# Altium schematic sheet BQ76930.SchDoc
size A4; SheetNumber: 3; SheetTotal: 5
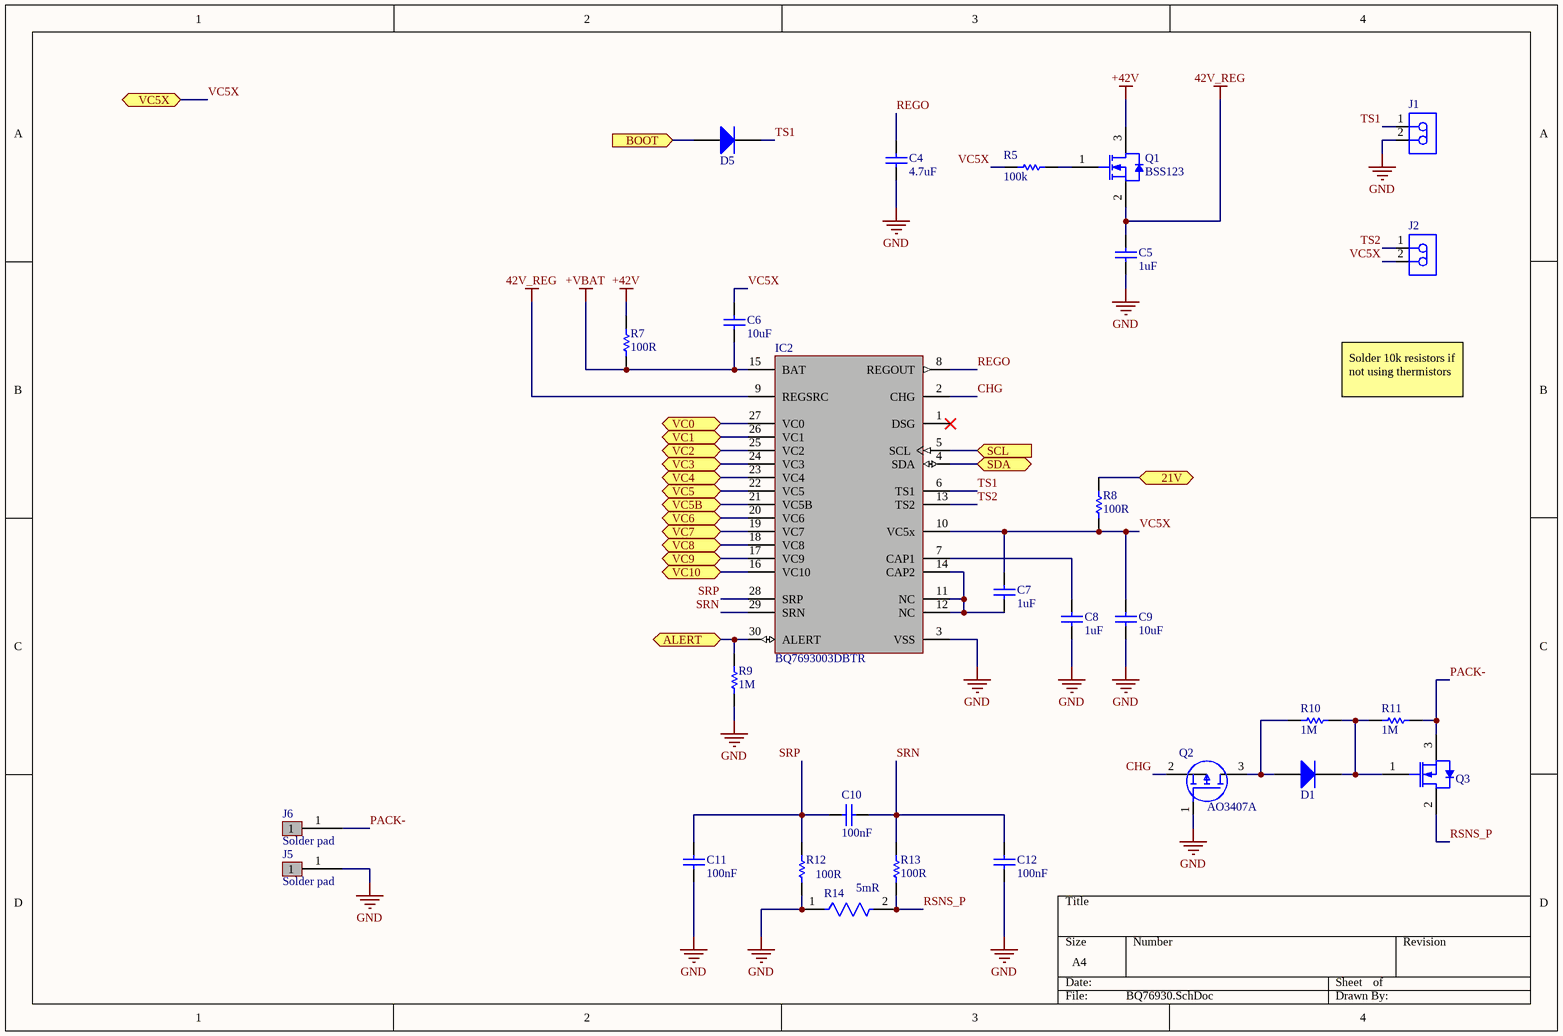
[diagram p0: BQ76930.SchDoc]

## Parts
C4  value 4.7uF  [Wurth 0603 capacitor]  (hidden comment: Generic Capacitor 4.7uF 0603)
C5  value 1uF  [Wurth 0603 capacitor]  (hidden comment: Generic Capacitor 1uF 0603)
C6  value 10uF  [Wurth 0603 capacitor]  (hidden comment: Generic Capacitor 10uF 0603)
C7  value 1uF  [Wurth 0603 capacitor]  (hidden comment: Generic Capacitor 1uF 0603)
C8  value 1uF  [Wurth 0603 capacitor]  (hidden comment: Generic Capacitor 1uF 0603)
C9  value 10uF  [Wurth 0603 capacitor]  (hidden comment: Generic Capacitor 10uF 0603)
C10  value 100nF  [Wurth 0603 capacitor]  (hidden comment: Generic Capacitor 100nF 0603)
C11  value 100nF  [Wurth 0603 capacitor]  (hidden comment: Generic Capacitor 100nF 0603)
C12  value 100nF  [Wurth 0603 capacitor]  (hidden comment: Generic Capacitor 100nF 0603)
D1  1N4148W-7-F  [DIOD-SOD123-2_V]  (value not drawn)
D5  1N4148W-7-F  [DIOD-SOD123-2_V]  (value not drawn)
IC2  BQ7693003DBTR  [Texas Instruments TSSOP-30 7.8X4.4MM]
J1  B2B-PH-K-S(LF)(SN)  [JST-B2B-PH-K-S_V]  (value not drawn)
J2  B2B-PH-K-S(LF)(SN)  [JST-B2B-PH-K-S_V]  (value not drawn)
J5  Solder pad  [Solder Pad 4X5MM]
J6  Solder pad  [Solder Pad 4X5MM]
Q1  BSS123  [FAIR-SOT23-3_V]
Q2  AO3407A  [UMW SOT23-3]
Q3  MDT18N20  [Minos TO-252-2L 6.3X9.6MM]  (value not drawn)
R5  value 100k  [Wurth 0603 Resistor]  (hidden comment: CRCW060310K0FKEA)
R7  value 100R  [Wurth 0603 Resistor]  (hidden comment: Generic Resistor 100R 0603)
R8  value 100R  [Wurth 0603 Resistor]  (hidden comment: Generic Resistor 100R 0603)
R9  value 1M  [Wurth 0603 Resistor]  (hidden comment: Generic Resistor 1M 0603)
R10  value 1M  [Wurth 0603 Resistor]  (hidden comment: Generic Resistor 1M 0603)
R11  value 1M  [Wurth 0603 Resistor]  (hidden comment: Generic Resistor 1M 0603)
R12  value 100R  [Wurth 0603 Resistor]  (hidden comment: Generic Resistor 100R 0603)
R13  value 100R  [Wurth 0603 Resistor]  (hidden comment: Generic Resistor 100R 0603)
R14  Resistance: 5mR  [FP-ERJM1WS-MFG]  (hidden comment: ERJ-M1WSF5M0U)

## Ports
21V (bidir), ALERT (bidir), BOOT (in), SCL (in), SDA (bidir), VC0 (bidir), VC1 (bidir), VC2 (bidir), VC3 (bidir), VC4 (bidir), VC5 (bidir), VC5B (bidir), VC5X (bidir), VC6 (bidir), VC7 (bidir), VC8 (bidir), VC9 (bidir), VC10 (bidir)

## Nets
42V_REG: C5.2 IC2.9(REGSRC) Q1.2(S)
+42V: Q1.3(D) R7.1
+VBAT: C6.1 IC2.15(BAT) R7.2
GND: C4.1 C5.1 C8.1 C9.1 C11.1 C12.1 IC2.3(VSS) J1.2 J5.1 Q2.1(G) R9.1 R12.1 R14.1
21V: R8.2 ; port 21V
ALERT: IC2.30(ALERT) R9.2 ; port ALERT
BOOT: D5.1(A) ; port BOOT
CHG: IC2.2(CHG) Q2.2(S)
PACK-: J6.1 Q3.3(S) R11.2
REGO: C4.2 IC2.8(REGOUT)
RSNS_P: Q3.2(D) R13.1 R14.2
SCL: IC2.5(SCL) ; port SCL
SDA: IC2.4(SDA) ; port SDA
SRN: C10.2 C12.2 IC2.29(SRN) R13.2
SRP: C10.1 C11.2 IC2.28(SRP) R12.2
TS1: D5.2(K) IC2.6(TS1) J1.1
TS2: IC2.13(TS2) J2.1
VC0: IC2.27(VC0) ; port VC0
VC1: IC2.26(VC1) ; port VC1
VC2: IC2.25(VC2) ; port VC2
VC3: IC2.24(VC3) ; port VC3
VC4: IC2.23(VC4) ; port VC4
VC5: IC2.22(VC5) ; port VC5
VC5B: IC2.21(VC5B) ; port VC5B
VC5X: C6.2 C7.2 C9.2 IC2.10(VC5x) J2.2 R5.2 R8.1 ; port VC5X
VC6: IC2.20(VC6) ; port VC6
VC7: IC2.19(VC7) ; port VC7
VC8: IC2.18(VC8) ; port VC8
VC9: IC2.17(VC9) ; port VC9
VC10: IC2.16(VC10) ; port VC10
NetC7_1: C7.1 IC2.11(NC) IC2.12(NC) IC2.14(CAP2)
NetC8_2: C8.2 IC2.7(CAP1)
NetD1_1: D1.1(A) Q2.3(D) R10.1
NetD1_2: D1.2(K) Q3.1(G) R10.2 R11.1
NetQ1_1: Q1.1(G) R5.1

Not connected (* = marked no-connect by the designer): IC2 1(DSG)*

## Notes on the sheet
- Solder 10k resistors if not using thermistors

## Library data of the parts
D1 D5 = CMP-2000-04932-2: Fast Switching Diode, 100 V, 0.15 A, -65 to 150 degC, 2-Pin?SOD123, RoHS, Tape and Reel; Recovery Time: 4ns; Brand: DiodesIncorporated; Unit Weight: 0.000353oz; Max Surge Current: 2A; Peak Reverse Voltage: 100V; Ir - Reverse Current: 1uA; Vf - Forward Voltage: 1.25V; Configuration: Single; If - Forward Current: 0.15A; Product Category: Diodes-GeneralPurpose,Power,Switching; Operating Temperature Range: -65Cto+150C; Packaging: Reel; Manufacturer URL: http://www.diodes.com/; Maximum Operating Temperature: +150C; Height: 1.25mm; Minimum Operating Temperature: -65C; Product: SwitchingDiodes; Package URL: http://www.diodes.com/datasheets/ds18004.pdf; Type: SwitchingDiode; Package Reference: SOD123-2; Width: 1.7mm; Datasheet URL: http://www.farnell.com/datasheets/1915529.pdf; Datasheet Version: Rev. 24-2, 10/2013; Series: 1N4148; Factory Pack Quantity: 3000; Length: 2.85mm; RoHS: True; Manufacturer: DiodesIncorporated; Mounting Style: SMD/SMT; Package / Case: SOD-123
IC2 = Texas instruments BQ7693003DBTR: Power Supply Support Circuit, Adjustable, 1 Channel, PDSO30; Max Supply Voltage: 25V; Nominal Supply Current: 40-130uA; Number Of Outputs: 2; Number Of Cells: 10; Standoff Height: 0.05mm; Min Supply Voltage: 6V; Package Body Material: Plastic; Adjustable Threshold: Yes; Number of Channels: 1; Octopart: https://octopart.com/bq7693003dbtr-texas+instruments-34472212; Digikey Description: IC BATT MGMT LI-ION AFE 30TSSOP; Manufacturer: Texas Instruments; Ipc Land Pattern Name: SOP50P635X120-30; Mouser Description: 6 to 10-Series Cell Li-Ion and Li-Phosphate Battery Monitor (bq76940 Family) 30-TSSOP -40 to 85; Package: DBT0030A; Manufacturer Part Number: BQ7693003DBTR; Device Class L1: Integrated Circuits (ICs); Temperature Range High: +85°C; RoHS: TRUE; Category: IC; Temperature: -40°C to +85°C; Automotive: No; Device Class L3: Battery Management; ComponentLink2Description: Datasheet; Device Class L2: Power Management ICs; ComponentLink2URL: http://www.ti.com/lit/ds/symlink/bq76930.pdf; Height: 1.2mm; Temperature Range Low: -40°C; Lead Free: Yes; Supplier: Mouser; Supplier Part Number: 595-BQ7693003DBTR; Stock: 4010; Pricing: 1=3,18, 10=2,75, 50=2,75, 100=2,54, 1000=2,15, 10000=1,96 (USD); Case/Package: TSSOP; Pins: 30; Package Shape: Rectangular; Terminal Finish: Nickel; Min Operating Temperature: -40°C; Max Operating Temperature: 85°C; JESD-609 Code: e4; Throw Configuration: POWER SUPPLY SUPPORT CIRCUIT; Moisture Sensitivity Level: 2; Channels: 1; Package Style: SMALL OUTLINE, THIN PROFILE, SHRINK PITCHMeter; Peak Reflow Temperature (Cel): 260°C; Surface Mount: Yes; Terminal Form: Gull Wing; Terminal Position: DUAL; Length: 7.8mm; Width: 4.4mm; Height - Seated (Max): 1.2mm; Terminal Pitch: 0.5mm; Reach SVHC Compliant: Yes; RoHS Compliant: Yes; Temperature Grade: INDUSTRIAL; ComponentLink1URL: https://www.ti.com:443/lit/ds/symlink/bq76920.pdf?src-supplier=IHS+Markit; ComponentLink1Description: https://www.ti.com:443/lit/ds/symlink/bq76920.pdf?src-supplier=IHS+Markit; ComponentLink3URL: http://www.ti.com/lit/gpn/bq76930?src-supplier=Mouser; ComponentLink3Description: http://www.ti.com/lit/gpn/bq76930?src-supplier=Mouser; ComponentLink4URL: http://www.ti.com/lit/ds/symlink/bq76930.pdf?src-supplier=Digikey; ComponentLink4Description: http://www.ti.com/lit/ds/symlink/bq76930.pdf?src-supplier=Digikey; ComponentLink5URL: http://www.ti.com/lit/pdf/slpt038?src-supplier=Digikey; ComponentLink5Description: http://www.ti.com/lit/pdf/slpt038?src-supplier=Digikey; ComponentLink6URL: http://www.ti.com/general/docs/lit/getliterature.tsp?genericPartNumber=BQ76920&&fileType=pdf&src-supplier=Avnet; ComponentLink6Description: http://www.ti.com/general/docs/lit/getliterature.tsp?genericPartNumber=BQ76920&&fileType=pdf&src-supplier=Avnet
J1 J2 = CMP-2000-05162-1: Male Header, Pitch 2 mm, 1 x 2 Position, Height 6 mm, Tail Length 3.4 mm, -25 to 85 degC, RoHS, Bulk; Manufacturer: JST; Pitch: 2mm; Style/Orientation: StraightHeader/Plug; No of Positions: 2; Datasheet Version: Nov-08; Datasheet URL: http://datasheet.octopart.com/B2B-PH-K-S%28LF%29%28SN%29-JST-datasheet-8324864.pdf; Manufacturer URL: http://www.jst.com/home2.html; Type: ShroudedHeader; Termination: Crimp
Q1 = CMP-2000-04934-1: N-Channel Logic Level Enhancement Mode Field Effect Transistor, 1.7 V, -55 to 150 degC, 3-Pin SOT-23, RoHS, Tape and Reel; Manufacturer: Fairchild; Channel Type: N; Typical Turn-Off Delay Time: 17ns; Maximum Continuous Drain Current: 0.17A; Rad Hard: No; Typical Rise Time: 9ns; Typical Fall Time: 2.4ns; Maximum Gate Source Voltage: ±20V; Maximum Drain Source Voltage: 100V; Typical Turn-On Delay Time: 1.7ns; RDS-on: 6000@10VmOhm; Package Version: Rev. 12, 03/2016; Packaging: Tape&Reel; Package Reference: SOT23-3; Channel Mode: Enhancement; Operating Temperature: -55to150degC; Package Description: 3-Pin Small Outline Transistor, Body 2.92 x 1.325 mm, Pitch 0.95 mm; Category: MOSFET; Datasheet Version: Jun-03; Datasheet URL: https://www.fairchildsemi.com/datasheets/BS/BSS123.pdf; Manufacturer URL: https://www.fairchildsemi.com/; Mounting: SurfaceMount; Package: 3SOT-23; Package URL: http://www.fairchildsemi.com/dwg/MA/MA03D.pdf
Q2 = UMW AO3407A: MOSFET (P-Channel); Manufacturer_Name: Alpha & Omega Semiconductors; Datasheet Link: http://www.aosmd.com/pdfs/datasheet/ao3407a.pdf; Height: 1.25mm; Manufacturer_Part_Number: AO3407A; Arrow Part Number: AO3407A; Arrow Price/Stock: https://www.arrow.com/en/products/ao3407a/alpha-and-omega-semiconductor?region=nac
Q3 = Minos MDT18N20: VDS = 200V,ID = 18A, VGS=30V
R5 = Generic Resistor 100k 0603
R14 = CMP-05422-000103-1: RES 0.005 OHM 1% 1W 2512; Temperature Coefficient: 100ppm/°C; Construction: Rectangular; Mount: Surface Mount; Case/Package: 2512; Package Quantity: 1; Technology: THICK FILM; RoHS Compliant: Yes; REACH SVHC: No SVHC; Size Code: 2512; Number of Terminations: 2; Max Operating Temperature: 170°C; Number of Pins: 2; Case Code (Metric): 6432; Depth: 3.2mm; Case Code (Imperial): 2512; Max Power Dissipation: 1W; Termination: SMD/SMT; Power Rating: 1W; Radiation Hardening: No; Tolerance: 1%; Packaging: Tape and Reel; Resistor Type: Metal Strip; Military Standard: Not; Lead Free: Lead Free; Height: 0.8mm; Min Operating Temperature: -55°C; Width: 3.2mm; Series: ERJ; Length: 6.4mm; Resistance Tolerance: 1%; Contact Plating: Tin